# EAGLE board K019 with eeprom (EAGLE 6.3), part 1 of 4
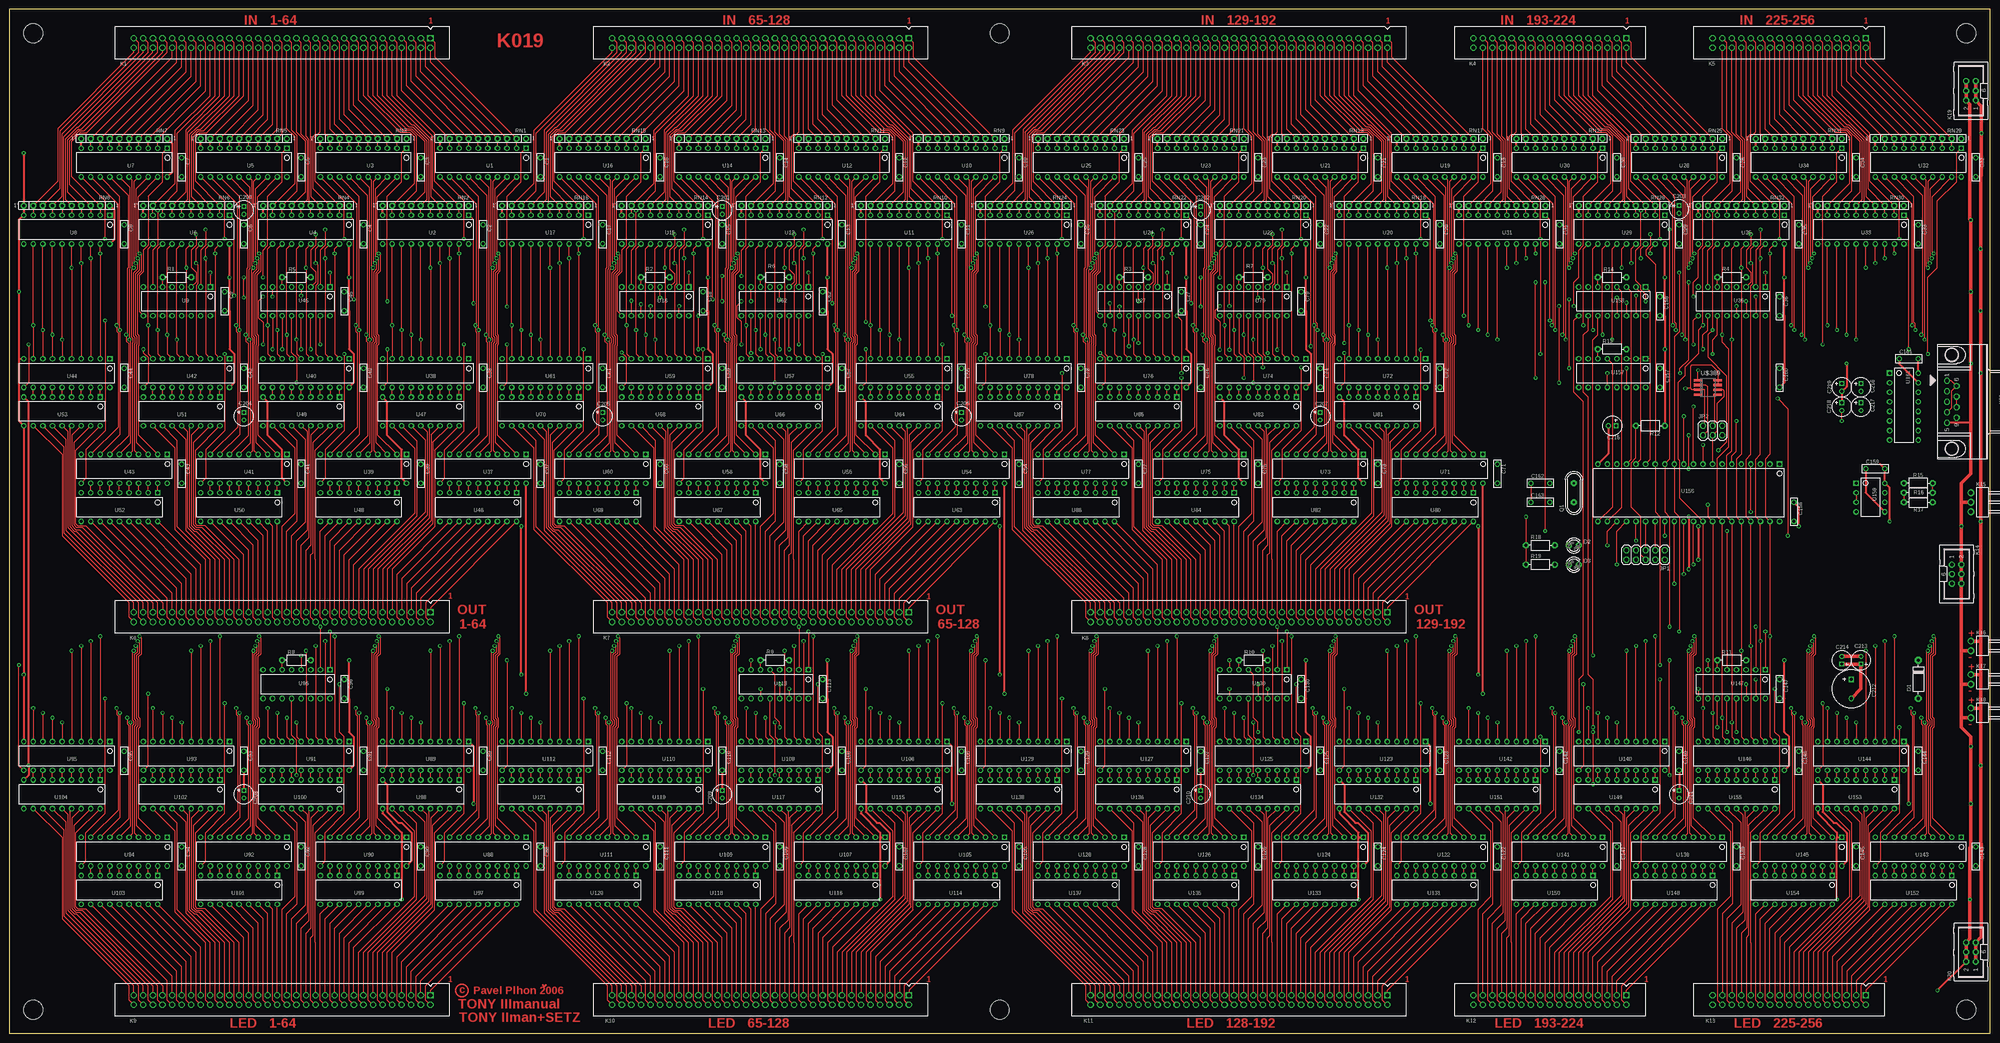
[diagram p5: board, top side]
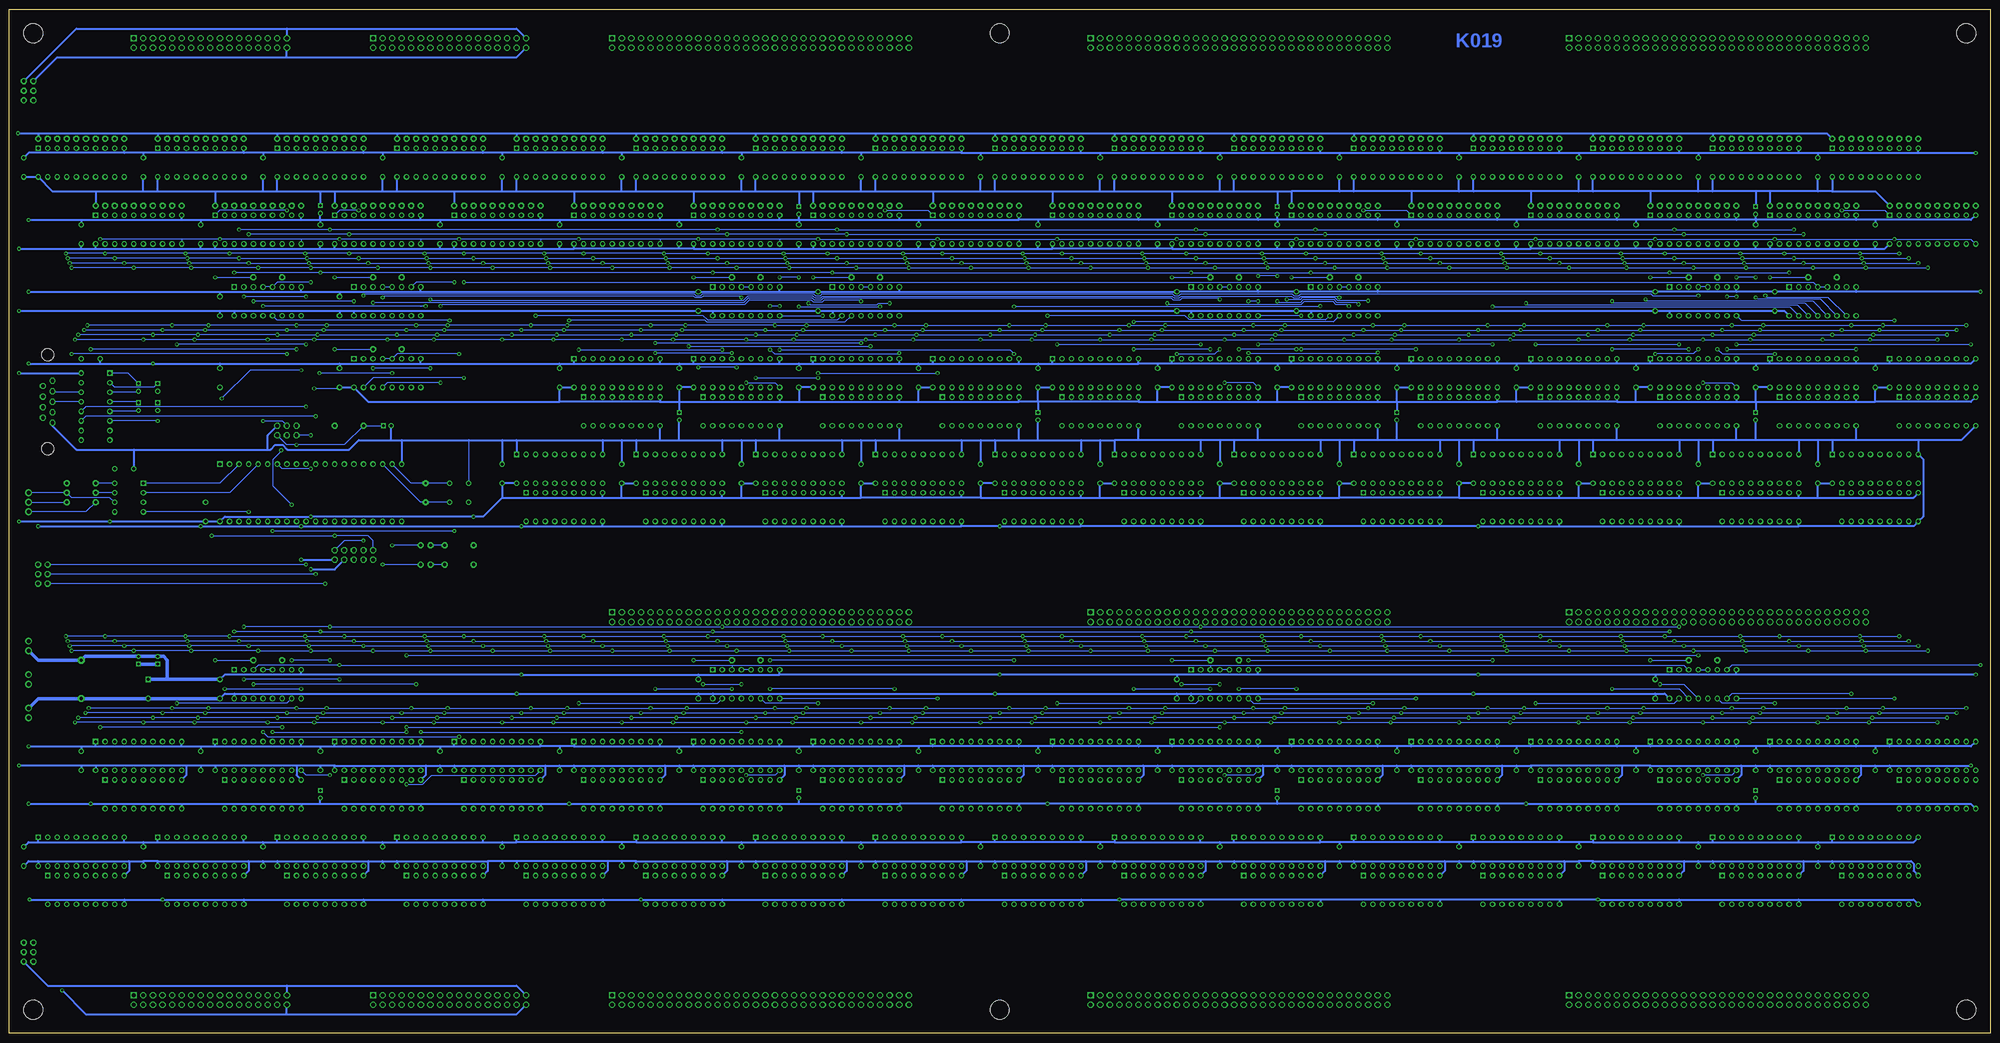
[diagram p6: board, bottom side, seen from below]

Size 525.78 x 271.78 mm. Coordinates in mm from the lower left corner, seen from the top.
Outline: 0,0 525.78,0 525.78,271.78 0,271.78 0,0
Copper layers (1*16): Top 0.035mm / dielectric 1.5mm / Bottom 0.035mm
Design rules "default": minimum track width 10mil, minimum drill 24mil, track to track 8mil, track to pad 8mil, pad to pad 8mil, via to via 8mil, smd to smd 8mil, copper to edge 40mil, drill to drill 8mil, minimum pad ring 10mil, minimum via ring 8mil, stop-mask expansion 4mil, vias tented up to drill 0mil, thermal gap 10mil
Holes 5.08 mm at 6.35,265.43 6.35,6.35 519.43,6.35 519.43,265.43 262.89,265.43 262.89,6.35

## Footprints (pad centres in the part's own frame; a part is rotated, then mirrored left to right if it is on the bottom)
C-5-2X8 = drill 0.813 pad 1.397: 1 0,0; 2 5.08,0
EC-2/5 = drill 0.711 pad 1.092: 1 1.016,0 | drill 0.711 pad 1.092 square: 2 -1.016,0
EC-5 = drill 0.813 pad 1.397 square: 1 -2.54,0 | drill 0.813 pad 1.397: 2 2.54,0
D-10 = drill 0.813 pad 1.778 octagon: 1 -5.08,0; 2 5.08,0
LED3 = drill 0.813 pad 1.6 octagon: A -1.27,0 | drill 0.813 pad 1.6: K 1.27,0
2X05 = drill 1.016 pad 1.6 octagon: 1 -5.08,-1.27; 2 -5.08,1.27; 3 -2.54,-1.27; 4 -2.54,1.27; 5 0,-1.27; 6 0,1.27; 7 2.54,-1.27; 8 2.54,1.27; 9 5.08,-1.27; 10 5.08,1.27
2X03 = drill 1.016 pad 1.6 octagon: 1 -2.54,-1.27; 2 -2.54,1.27; 3 0,-1.27; 4 0,1.27; 5 2.54,-1.27; 6 2.54,1.27
KON64 = drill 1.092 pad 1.6 square: 1 0,0 | drill 1.092 pad 1.6: 2 0,2.54; 3 2.54,0; 4 2.54,2.54; 5 5.08,0; 6 5.08,2.54; 7 7.62,0; 8 7.62,2.54; 9 10.16,0; 10 10.16,2.54; 11 12.7,0; 12 12.7,2.54; 13 15.24,0; 14 15.24,2.54; 15 17.78,0; 16 17.78,2.54; 17 20.32,0; 18 20.32,2.54; 19 22.86,0; 20 22.86,2.54; 21 25.4,0; 22 25.4,2.54; 23 27.94,0; 24 27.94,2.54; 25 30.48,0; 26 30.48,2.54; 27 33.02,0; 28 33.02,2.54; 29 35.56,0; 30 35.56,2.54; 31 38.1,0; 32 38.1,2.54; 33 40.64,0; 34 40.64,2.54; 35 43.18,0; 36 43.18,2.54; 37 45.72,0; 38 45.72,2.54; 39 48.26,0; 40 48.26,2.54; 41 50.8,0; 42 50.8,2.54; 43 53.34,0; 44 53.34,2.54; 45 55.88,0; 46 55.88,2.54; 47 58.42,0; 48 58.42,2.54; 49 60.96,0; 50 60.96,2.54; 51 63.5,0; 52 63.5,2.54; 53 66.04,0; 54 66.04,2.54; 55 68.58,0; 56 68.58,2.54; 57 71.12,0; 58 71.12,2.54; 59 73.66,0; 60 73.66,2.54; 61 76.2,0; 62 76.2,2.54; 63 78.74,0; 64 78.74,2.54
KON34 = drill 1.092 pad 1.6 square: 1 0,0 | drill 1.092 pad 1.6: 2 0,2.54; 3 2.54,0; 4 2.54,2.54; 5 5.08,0; 6 5.08,2.54; 7 7.62,0; 8 7.62,2.54; 9 10.16,0; 10 10.16,2.54; 11 12.7,0; 12 12.7,2.54; 13 15.24,0; 14 15.24,2.54; 15 17.78,0; 16 17.78,2.54; 17 20.32,0; 18 20.32,2.54; 19 22.86,0; 20 22.86,2.54; 21 25.4,0; 22 25.4,2.54; 23 27.94,0; 24 27.94,2.54; 25 30.48,0; 26 30.48,2.54; 27 33.02,0; 28 33.02,2.54; 29 35.56,0; 30 35.56,2.54; 31 38.1,0; 32 38.1,2.54; 33 40.64,0; 34 40.64,2.54
ML6 = drill 0.914 pad 1.6: 1 -2.54,-1.27 | drill 0.914 pad 1.6 octagon: 2 -2.54,1.27; 3 0,-1.27; 4 0,1.27; 5 2.54,-1.27; 6 2.54,1.27
PSH02-03 = drill 1.092 pad 1.803: 1 0,0; 2 2.54,0; 3 5.08,0
PSH02-02 = drill 1.092 pad 1.803: 1 0,0; 2 2.54,0
ML06 = drill 0.914 pad 1.6: 1 -2.54,-1.27 | drill 0.914 pad 1.6 octagon: 2 -2.54,1.27; 3 0,-1.27; 4 0,1.27; 5 2.54,-1.27; 6 2.54,1.27
D-09F/90 = drill 1.016 pad 1.575 octagon: 1 -5.588,-1.27; 2 -2.794,-1.27; 3 0,-1.27; 4 2.794,-1.27; 5 5.588,-1.27; 6 -4.191,1.27; 7 -1.397,1.27; 8 1.397,1.27; 9 4.191,1.27 | hole 3.2: 12.446,0; -12.446,0
QS = drill 0.61 pad 1.6 octagon: 1 -2.54,0; 2 2.54,0
R-7,5 = drill 0.813 pad 1.6 octagon: 1 -3.81,0; 2 3.81,0
G08R+ = drill 0.813 pad 1.6: 1 -10.16,0; 10 12.7,0 | drill 0.813 pad 1.6 octagon: 2 -7.62,0; 3 -5.08,0; 4 -2.54,0; 5 0,0; 6 2.54,0; 7 5.08,0; 8 7.62,0; 9 10.16,0
DIL20 = drill 0.813 pad 1.397 square: 1 0,0 | drill 0.813 pad 1.397: 2 2.54,0; 3 5.08,0; 4 7.62,0; 5 10.16,0; 6 12.7,0; 7 15.24,0; 8 17.78,0; 9 20.32,0; 10 22.86,0; 11 22.86,7.62; 12 20.32,7.62; 13 17.78,7.62; 14 15.24,7.62; 15 12.7,7.62; 16 10.16,7.62; 17 7.62,7.62; 18 5.08,7.62; 19 2.54,7.62; 20 0,7.62
DIL16 = drill 0.813 pad 1.397 square: 1 0,0 | drill 0.813 pad 1.397: 2 2.54,0; 3 5.08,0; 4 7.62,0; 5 10.16,0; 6 12.7,0; 7 15.24,0; 8 17.78,0; 9 17.78,7.62; 10 15.24,7.62; 11 12.7,7.62; 12 10.16,7.62; 13 7.62,7.62; 14 5.08,7.62; 15 2.54,7.62; 16 0,7.62
DIL18 = drill 0.813 pad 1.397 square: 1 0,0 | drill 0.813 pad 1.397: 2 2.54,0; 3 5.08,0; 4 7.62,0; 5 10.16,0; 6 12.7,0; 7 15.24,0; 8 17.78,0; 9 20.32,0; 10 20.32,7.62; 11 17.78,7.62; 12 15.24,7.62; 13 12.7,7.62; 14 10.16,7.62; 15 7.62,7.62; 16 5.08,7.62; 17 2.54,7.62; 18 0,7.62
DIL40 = drill 0.813 pad 1.397 square: 1 -24.13,-7.62 | drill 0.813 pad 1.397: 2 -21.59,-7.62; 3 -19.05,-7.62; 4 -16.51,-7.62; 5 -13.97,-7.62; 6 -11.43,-7.62; 7 -8.89,-7.62; 8 -6.35,-7.62; 9 -3.81,-7.62; 10 -1.27,-7.62; 11 1.27,-7.62; 12 3.81,-7.62; 13 6.35,-7.62; 14 8.89,-7.62; 15 11.43,-7.62; 16 13.97,-7.62; 17 16.51,-7.62; 18 19.05,-7.62; 19 21.59,-7.62; 20 24.13,-7.62; 21 24.13,7.62; 22 21.59,7.62; 23 19.05,7.62; 24 16.51,7.62; 25 13.97,7.62; 26 11.43,7.62; 27 8.89,7.62; 28 6.35,7.62; 29 3.81,7.62; 30 1.27,7.62; 31 -1.27,7.62; 32 -3.81,7.62; 33 -6.35,7.62; 34 -8.89,7.62; 35 -11.43,7.62; 36 -13.97,7.62; 37 -16.51,7.62; 38 -19.05,7.62; 39 -21.59,7.62; 40 -24.13,7.62
DIL-08 = drill 0.813 pad 1.397 square: 1 0,0 | drill 0.813 pad 1.397: 2 2.54,0; 3 5.08,0; 4 7.62,0; 5 7.62,7.62; 6 5.08,7.62; 7 2.54,7.62; 8 0,7.62
SO08 = smd 0.6 x 2.2: 1 -1.905,-2.6; 2 -0.635,-2.6; 3 0.635,-2.6; 4 1.905,-2.6; 5 1.905,2.6; 6 0.635,2.6; 7 -0.635,2.6; 8 -1.905,2.6

## Placement (x,y rotation side)
C1  100n  [C-5-2X8]  140.97,232.41 270 top
C2  100n  [C-5-2X8]  125.73,214.63 270 top
C3  100n  [C-5-2X8]  109.22,232.41 270 top
C4  100n  [C-5-2X8]  93.98,214.63 270 top
C5  100n  [C-5-2X8]  77.47,232.41 270 top
C6  100n  [C-5-2X8]  62.23,214.63 270 top
C7  100n  [C-5-2X8]  45.72,232.41 270 top
C8  100n  [C-5-2X8]  30.48,214.63 270 top
C9  100n  [C-5-2X8]  57.15,196.85 270 top
C10  100n  [C-5-2X8]  267.97,232.41 270 top
C11  100n  [C-5-2X8]  252.73,214.63 270 top
C12  100n  [C-5-2X8]  236.22,232.41 270 top
C13  100n  [C-5-2X8]  220.98,214.63 270 top
C14  100n  [C-5-2X8]  204.47,232.41 270 top
C15  100n  [C-5-2X8]  189.23,214.63 270 top
C16  100n  [C-5-2X8]  172.72,232.41 270 top
C17  100n  [C-5-2X8]  157.48,214.63 270 top
C18  100n  [C-5-2X8]  184.15,196.85 270 top
C19  100n  [C-5-2X8]  394.97,232.41 270 top
C20  100n  [C-5-2X8]  379.73,214.63 270 top
C21  100n  [C-5-2X8]  363.22,232.41 270 top
C22  100n  [C-5-2X8]  347.98,214.63 270 top
C23  100n  [C-5-2X8]  331.47,232.41 270 top
C24  100n  [C-5-2X8]  316.23,214.63 270 top
C25  100n  [C-5-2X8]  299.72,232.41 270 top
C26  100n  [C-5-2X8]  284.48,214.63 270 top
C27  100n  [C-5-2X8]  311.15,196.85 270 top
C28  100n  [C-5-2X8]  458.47,232.41 270 top
C29  100n  [C-5-2X8]  443.23,214.63 270 top
C30  100n  [C-5-2X8]  426.72,232.41 270 top
C31  100n  [C-5-2X8]  411.48,214.63 270 top
C32  100n  [C-5-2X8]  521.97,232.41 270 top
C33  100n  [C-5-2X8]  506.73,214.63 270 top
C34  100n  [C-5-2X8]  490.22,232.41 270 top
C35  100n  [C-5-2X8]  474.98,214.63 270 top
C36  100n  [C-5-2X8]  469.9,195.58 270 top
C37  100n  [C-5-2X8]  140.97,151.13 270 top
C38  100n  [C-5-2X8]  125.73,176.53 270 top
C39  100n  [C-5-2X8]  109.22,151.13 270 top
C40  100n  [C-5-2X8]  93.98,176.53 270 top
C41  100n  [C-5-2X8]  77.47,151.13 270 top
C42  100n  [C-5-2X8]  62.23,176.53 270 top
C43  100n  [C-5-2X8]  45.72,151.13 270 top
C44  100n  [C-5-2X8]  30.48,176.53 270 top
C45  100n  [C-5-2X8]  88.9,196.85 270 top
C54  100n  [C-5-2X8]  267.97,151.13 270 top
C55  100n  [C-5-2X8]  252.73,176.53 270 top
C56  100n  [C-5-2X8]  236.22,151.13 270 top
C57  100n  [C-5-2X8]  220.98,176.53 270 top
C58  100n  [C-5-2X8]  204.47,151.13 270 top
C59  100n  [C-5-2X8]  189.23,176.53 270 top
C60  100n  [C-5-2X8]  172.72,151.13 270 top
C61  100n  [C-5-2X8]  157.48,176.53 270 top
C62  100n  [C-5-2X8]  215.9,196.85 270 top
C71  100n  [C-5-2X8]  394.97,151.13 270 top
C72  100n  [C-5-2X8]  379.73,176.53 270 top
C73  100n  [C-5-2X8]  363.22,151.13 270 top
C74  100n  [C-5-2X8]  347.98,176.53 270 top
C75  100n  [C-5-2X8]  331.47,151.13 270 top
C76  100n  [C-5-2X8]  316.23,176.53 270 top
C77  100n  [C-5-2X8]  299.72,151.13 270 top
C78  100n  [C-5-2X8]  284.48,176.53 270 top
C79  100n  [C-5-2X8]  342.9,196.85 270 top
C88  100n  [C-5-2X8]  140.97,49.53 270 top
C89  100n  [C-5-2X8]  125.73,74.93 270 top
C90  100n  [C-5-2X8]  109.22,49.53 270 top
C91  100n  [C-5-2X8]  93.98,74.93 270 top
C92  100n  [C-5-2X8]  77.47,49.53 270 top
C93  100n  [C-5-2X8]  62.23,74.93 270 top
C94  100n  [C-5-2X8]  45.72,49.53 270 top
C95  100n  [C-5-2X8]  30.48,74.93 270 top
C96  100n  [C-5-2X8]  88.9,93.98 270 top
C105  100n  [C-5-2X8]  267.97,49.53 270 top
C106  100n  [C-5-2X8]  252.73,74.93 270 top
C107  100n  [C-5-2X8]  236.22,49.53 270 top
C108  100n  [C-5-2X8]  220.98,74.93 270 top
C109  100n  [C-5-2X8]  204.47,49.53 270 top
C110  100n  [C-5-2X8]  189.23,74.93 270 top
C111  100n  [C-5-2X8]  172.72,49.53 270 top
C112  100n  [C-5-2X8]  157.48,74.93 270 top
C113  100n  [C-5-2X8]  215.9,93.98 270 top
C122  100n  [C-5-2X8]  394.97,49.53 270 top
C123  100n  [C-5-2X8]  379.73,74.93 270 top
C124  100n  [C-5-2X8]  363.22,49.53 270 top
C125  100n  [C-5-2X8]  347.98,74.93 270 top
C126  100n  [C-5-2X8]  331.47,49.53 270 top
C127  100n  [C-5-2X8]  316.23,74.93 270 top
C128  100n  [C-5-2X8]  299.72,49.53 270 top
C129  100n  [C-5-2X8]  284.48,74.93 270 top
C130  100n  [C-5-2X8]  342.9,93.98 270 top
C139  100n  [C-5-2X8]  458.47,49.53 270 top
C140  100n  [C-5-2X8]  443.23,74.93 270 top
C141  100n  [C-5-2X8]  426.72,49.53 270 top
C142  100n  [C-5-2X8]  411.48,74.93 270 top
C143  100n  [C-5-2X8]  521.97,49.53 270 top
C144  100n  [C-5-2X8]  506.73,74.93 270 top
C145  100n  [C-5-2X8]  490.22,49.53 270 top
C146  100n  [C-5-2X8]  474.98,74.93 270 top
C147  100n  [C-5-2X8]  469.9,93.98 270 top
C156  100n  [C-5-2X8]  473.71,140.97 270 top
C157  100n  [C-5-2X8]  438.15,176.53 270 top
C158  100n  [C-5-2X8]  438.15,195.58 270 top
C159  100n  [C-5-2X8]  492.76,149.86 0 top
C160  100n  [C-5-2X8]  469.9,176.53 270 top
C161  100n  [C-5-2X8]  501.65,179.07 0 top
C162  22  [C-5-2X8]  403.86,146.05 0 top
C163  22  [C-5-2X8]  403.86,140.97 0 top
C200  22M  [EC-2/5]  62.23,218.44 270 top
C201  22M  [EC-2/5]  189.23,218.44 270 top
C202  22M  [EC-2/5]  316.23,218.44 270 top
C203  22M  [EC-2/5]  443.23,218.69 270 top
C204  22M  [EC-2/5]  62.23,163.83 270 top
C205  22M  [EC-2/5]  157.48,163.83 270 top
C206  22M  [EC-2/5]  252.73,163.83 270 top
C207  22M  [EC-2/5]  347.98,163.83 270 top
C208  22M  [EC-2/5]  62.23,63.5 270 top
C209  22M  [EC-2/5]  189.23,63.5 270 top
C210  22M  [EC-2/5]  316.23,63.5 270 top
C211  22M  [EC-2/5]  443.23,63.5 270 top
C212  220M  [EC-5]  488.95,91.44 270 top
C213  22M  [EC-2/5]  491.49,99.06 90 top
C214  22M  [EC-2/5]  486.41,99.06 90 top
C215  2M2  [EC-2/5]  425.45,161.29 180 top
C216  2M2  [EC-2/5]  491.49,171.45 270 top
C217  2M2  [EC-2/5]  491.49,166.37 270 top
C218  2M2  [EC-2/5]  486.41,166.37 270 top
C219  2M2  [EC-2/5]  486.41,171.45 270 top
D1  5V6  [D-10]  506.73,93.98 90 top
D2  LEDG  [LED3]  415.29,129.54 0 top
D3  LEDR  [LED3]  415.29,124.46 0 top
JP1  JTAG  [2X05]  434.34,127 180 top
JP2  ISP  [2X03]  452.12,160.02 0 top
K1  KON64  [KON64]  111.76,264.16 180 top
K2  KON64  [KON64]  238.76,264.16 180 top
K3  KON64  [KON64]  365.76,264.16 180 top
K4  KON34  [KON34]  429.26,264.16 180 top
K5  KON34  [KON34]  492.76,264.16 180 top
K6  KON64  [KON64]  111.76,111.76 180 top
K7  KON64  [KON64]  238.76,111.76 180 top
K8  KON64  [KON64]  365.76,111.76 180 top
K9  KON64  [KON64]  111.76,10.16 180 top
K10  KON64  [KON64]  238.76,10.16 180 top
K11  KON64  [KON64]  365.76,10.16 180 top
K12  KON34  [KON34]  429.26,10.16 180 top
K13  KON34  [KON34]  492.76,10.16 180 top
K14  KLIC  [ML6]  516.89,121.92 270 top
K15  PSH02-03W  [PSH02-03]  520.7,143.51 270 top
K16  PSH02-02W  [PSH02-02]  520.7,104.14 270 top
K17  PSH02-02W  [PSH02-02]  520.7,95.25 270 top
K18  PSH02-02W  [PSH02-02]  520.7,86.36 270 top
K19  PWR  [ML06]  520.7,250.19 90 top
K20  PWR  [ML06]  520.7,21.59 90 top
K21  RS232  [D-09F/90]  515.62,167.64 270 top
Q1  14.745MHz  [QS]  415.29,143.51 90 top
R1  1k  [R-7,5]  44.45,200.66 0 top
R2  1k  [R-7,5]  171.45,200.66 0 top
R3  1k  [R-7,5]  298.45,200.66 0 top
R4  1k  [R-7,5]  457.2,200.66 0 top
R5  1k  [R-7,5]  76.2,200.66 180 top
R6  1k  [R-7,5]  203.2,200.66 180 top
R7  1k  [R-7,5]  330.2,200.66 180 top
R8  1k  [R-7,5]  76.2,99.06 180 top
R9  1k  [R-7,5]  203.2,99.06 180 top
R10  1k  [R-7,5]  330.2,99.06 180 top
R11  1k  [R-7,5]  457.2,99.06 180 top
R12  10k  [R-7,5]  435.61,161.29 180 top
R13  1k  [R-7,5]  425.45,181.61 180 top
R14  1k  [R-7,5]  425.45,200.66 180 top
R15  2k2  [R-7,5]  506.73,146.05 180 top
R16  120  [R-7,5]  506.73,143.51 0 top
R17  2k2  [R-7,5]  506.73,140.97 180 top
R18  1k  [R-7,5]  406.4,129.54 0 top
R19  1k  [R-7,5]  406.4,124.46 0 top
RN1  8x47k  [G08R+]  127,237.49 180 top
RN2  8x47k  [G08R+]  111.76,219.71 180 top
RN3  8x47k  [G08R+]  95.25,237.49 180 top
RN4  8x47k  [G08R+]  80.01,219.71 180 top
RN5  8x47k  [G08R+]  63.5,237.49 180 top
RN6  8x47k  [G08R+]  48.26,219.71 180 top
RN7  8x47k  [G08R+]  31.75,237.49 180 top
RN8  8x47k  [G08R+]  16.51,219.71 180 top
RN9  8x47k  [G08R+]  254,237.49 180 top
RN10  8x47k  [G08R+]  238.76,219.71 180 top
RN11  8x47k  [G08R+]  222.25,237.49 180 top
RN12  8x47k  [G08R+]  207.01,219.71 180 top
RN13  8x47k  [G08R+]  190.5,237.49 180 top
RN14  8x47k  [G08R+]  175.26,219.71 180 top
RN15  8x47k  [G08R+]  158.75,237.49 180 top
RN16  8x47k  [G08R+]  143.51,219.71 180 top
RN17  8x47k  [G08R+]  381,237.49 180 top
RN18  8x47k  [G08R+]  365.76,219.71 180 top
RN19  8x47k  [G08R+]  349.25,237.49 180 top
RN20  8x47k  [G08R+]  334.01,219.71 180 top
RN21  8x47k  [G08R+]  317.5,237.49 180 top
RN22  8x47k  [G08R+]  302.26,219.71 180 top
RN23  8x47k  [G08R+]  285.75,237.49 180 top
RN24  8x47k  [G08R+]  270.51,219.71 180 top
RN25  8x47k  [G08R+]  444.5,237.49 180 top
RN26  8x47k  [G08R+]  429.26,219.71 180 top
RN27  8x47k  [G08R+]  412.75,237.49 180 top
RN28  8x47k  [G08R+]  397.51,219.71 180 top
RN29  8x47k  [G08R+]  508,237.49 180 top
RN30  8x47k  [G08R+]  492.76,219.71 180 top
RN31  8x47k  [G08R+]  476.25,237.49 180 top
RN32  8x47k  [G08R+]  461.01,219.71 180 top
U1  74HC573  [DIL20]  137.16,234.95 180 top
U2  74HC573  [DIL20]  121.92,217.17 180 top
U3  74HC573  [DIL20]  105.41,234.95 180 top
U4  74HC573  [DIL20]  90.17,217.17 180 top
U5  74HC573  [DIL20]  73.66,234.95 180 top
U6  74AC573  [DIL20]  58.42,217.17 180 top
U7  74HC573  [DIL20]  41.91,234.95 180 top
U8  74HC573  [DIL20]  26.67,217.17 180 top
U9  74AC138  [DIL16]  53.34,198.12 180 top
U10  74HC573  [DIL20]  264.16,234.95 180 top
U11  74HC573  [DIL20]  248.92,217.17 180 top
U12  74HC573  [DIL20]  232.41,234.95 180 top
U13  74HC573  [DIL20]  217.17,217.17 180 top
U14  74HC573  [DIL20]  200.66,234.95 180 top
U15  74AC573  [DIL20]  185.42,217.17 180 top
U16  74HC573  [DIL20]  168.91,234.95 180 top
U17  74HC573  [DIL20]  153.67,217.17 180 top
U18  74AC138  [DIL16]  180.34,198.12 180 top
U19  74HC573  [DIL20]  391.16,234.95 180 top
U20  74HC573  [DIL20]  375.92,217.17 180 top
U21  74HC573  [DIL20]  359.41,234.95 180 top
U22  74HC573  [DIL20]  344.17,217.17 180 top
U23  74HC573  [DIL20]  327.66,234.95 180 top
U24  74AC573  [DIL20]  312.42,217.17 180 top
U25  74HC573  [DIL20]  295.91,234.95 180 top
U26  74HC573  [DIL20]  280.67,217.17 180 top
U27  74AC138  [DIL16]  307.34,198.12 180 top
U28  74HC573  [DIL20]  454.66,234.95 180 top
U29  74HC573  [DIL20]  439.42,217.17 180 top
U30  74HC573  [DIL20]  422.91,234.95 180 top
U31  74HC573  [DIL20]  407.67,217.17 180 top
U32  74HC573  [DIL20]  518.16,234.95 180 top
U33  74AC573  [DIL20]  502.92,217.17 180 top
U34  74HC573  [DIL20]  486.41,234.95 180 top
U35  74HC573  [DIL20]  471.17,217.17 180 top
U36  74AC138  [DIL16]  466.09,198.12 180 top
U37  74HC574  [DIL20]  137.16,153.67 180 top
U38  74HC574  [DIL20]  121.92,179.07 180 top
U39  74HC574  [DIL20]  105.41,153.67 180 top
U40  74HC574  [DIL20]  90.17,179.07 180 top
U41  74HC574  [DIL20]  73.66,153.67 180 top
U42  74HC574  [DIL20]  58.42,179.07 180 top
U43  74HC574  [DIL20]  41.91,153.67 180 top
U44  74HC574  [DIL20]  26.67,179.07 180 top
U45  74HC138  [DIL16]  85.09,198.12 180 top
U46  TD62783F  [DIL18]  134.62,143.51 180 top
U47  TD62783F  [DIL18]  119.38,168.91 180 top
U48  TD62783F  [DIL18]  102.87,143.51 180 top
U49  TD62783F  [DIL18]  87.63,168.91 180 top
U50  TD62783F  [DIL18]  71.12,143.51 180 top
U51  TD62783F  [DIL18]  55.88,168.91 180 top
U52  TD62783F  [DIL18]  39.37,143.51 180 top
U53  TD62783F  [DIL18]  24.13,168.91 180 top
U54  74HC574  [DIL20]  264.16,153.67 180 top
U55  74HC574  [DIL20]  248.92,179.07 180 top
U56  74HC574  [DIL20]  232.41,153.67 180 top
U57  74HC574  [DIL20]  217.17,179.07 180 top
U58  74HC574  [DIL20]  200.66,153.67 180 top
U59  74HC574  [DIL20]  185.42,179.07 180 top
U60  74HC574  [DIL20]  168.91,153.67 180 top
U61  74HC574  [DIL20]  153.67,179.07 180 top
U62  74HC138  [DIL16]  212.09,198.12 180 top
U63  TD62783F  [DIL18]  261.62,143.51 180 top
U64  TD62783F  [DIL18]  246.38,168.91 180 top
U65  TD62783F  [DIL18]  229.87,143.51 180 top
U66  TD62783F  [DIL18]  214.63,168.91 180 top
U67  TD62783F  [DIL18]  198.12,143.51 180 top
U68  TD62783F  [DIL18]  182.88,168.91 180 top
U69  TD62783F  [DIL18]  166.37,143.51 180 top
U70  TD62783F  [DIL18]  151.13,168.91 180 top
U71  74HC574  [DIL20]  391.16,153.67 180 top
U72  74HC574  [DIL20]  375.92,179.07 180 top
U73  74HC574  [DIL20]  359.41,153.67 180 top
U74  74HC574  [DIL20]  344.17,179.07 180 top
U75  74HC574  [DIL20]  327.66,153.67 180 top
U76  74HC574  [DIL20]  312.42,179.07 180 top
U77  74HC574  [DIL20]  295.91,153.67 180 top
U78  74HC574  [DIL20]  280.67,179.07 180 top
U79  74HC138  [DIL16]  339.09,198.12 180 top
U80  TD62783F  [DIL18]  388.62,143.51 180 top
U81  TD62783F  [DIL18]  373.38,168.91 180 top
U82  TD62783F  [DIL18]  356.87,143.51 180 top
U83  TD62783F  [DIL18]  341.63,168.91 180 top
U84  TD62783F  [DIL18]  325.12,143.51 180 top
U85  TD62783F  [DIL18]  309.88,168.91 180 top
U86  TD62783F  [DIL18]  293.37,143.51 180 top
U87  TD62783F  [DIL18]  278.13,168.91 180 top
U88  74HC574  [DIL20]  137.16,52.07 180 top
U89  74HC574  [DIL20]  121.92,77.47 180 top
U90  74HC574  [DIL20]  105.41,52.07 180 top
U91  74HC574  [DIL20]  90.17,77.47 180 top
U92  74HC574  [DIL20]  73.66,52.07 180 top
U93  74HC574  [DIL20]  58.42,77.47 180 top
U94  74HC574  [DIL20]  41.91,52.07 180 top
U95  74HC574  [DIL20]  26.67,77.47 180 top
U96  74HC138  [DIL16]  85.09,96.52 180 top
U97  TD62783F  [DIL18]  134.62,41.91 180 top
U98  TD62783F  [DIL18]  119.38,67.31 180 top
U99  TD62783F  [DIL18]  102.87,41.91 180 top
U100  TD62783F  [DIL18]  87.63,67.31 180 top
U101  TD62783F  [DIL18]  71.12,41.91 180 top
U102  TD62783F  [DIL18]  55.88,67.31 180 top
U103  TD62783F  [DIL18]  39.37,41.91 180 top
U104  TD62783F  [DIL18]  24.13,67.31 180 top
U105  74HC574  [DIL20]  264.16,52.07 180 top
U106  74HC574  [DIL20]  248.92,77.47 180 top
U107  74HC574  [DIL20]  232.41,52.07 180 top
U108  74HC574  [DIL20]  217.17,77.47 180 top
U109  74HC574  [DIL20]  200.66,52.07 180 top
U110  74HC574  [DIL20]  185.42,77.47 180 top
U111  74HC574  [DIL20]  168.91,52.07 180 top
U112  74HC574  [DIL20]  153.67,77.47 180 top
U113  74HC138  [DIL16]  212.09,96.52 180 top
U114  TD62783F  [DIL18]  261.62,41.91 180 top
U115  TD62783F  [DIL18]  246.38,67.31 180 top
U116  TD62783F  [DIL18]  229.87,41.91 180 top
U117  TD62783F  [DIL18]  214.63,67.31 180 top
U118  TD62783F  [DIL18]  198.12,41.91 180 top
U119  TD62783F  [DIL18]  182.88,67.31 180 top
U120  TD62783F  [DIL18]  166.37,41.91 180 top
U121  TD62783F  [DIL18]  151.13,67.31 180 top
U122  74HC574  [DIL20]  391.16,52.07 180 top
U123  74HC574  [DIL20]  375.92,77.47 180 top
U124  74HC574  [DIL20]  359.41,52.07 180 top
U125  74HC574  [DIL20]  344.17,77.47 180 top
U126  74HC574  [DIL20]  327.66,52.07 180 top
U127  74HC574  [DIL20]  312.42,77.47 180 top
U128  74HC574  [DIL20]  295.91,52.07 180 top
U129  74HC574  [DIL20]  280.67,77.47 180 top
U130  74HC138  [DIL16]  339.09,96.52 180 top
U131  TD62783F  [DIL18]  388.62,41.91 180 top
U132  TD62783F  [DIL18]  373.38,67.31 180 top
U133  TD62783F  [DIL18]  356.87,41.91 180 top
U134  TD62783F  [DIL18]  341.63,67.31 180 top
U135  TD62783F  [DIL18]  325.12,41.91 180 top
U136  TD62783F  [DIL18]  309.88,67.31 180 top
U137  TD62783F  [DIL18]  293.37,41.91 180 top
U138  TD62783F  [DIL18]  278.13,67.31 180 top
U139  74HC574  [DIL20]  454.66,52.07 180 top
U140  74HC574  [DIL20]  439.42,77.47 180 top
U141  74HC574  [DIL20]  422.91,52.07 180 top
U142  74HC574  [DIL20]  407.67,77.47 180 top
U143  74HC574  [DIL20]  518.16,52.07 180 top
U144  74HC574  [DIL20]  502.92,77.47 180 top
U145  74HC574  [DIL20]  486.41,52.07 180 top
U146  74HC574  [DIL20]  471.17,77.47 180 top
U147  74HC138  [DIL16]  466.09,96.52 180 top
U148  TD62783F  [DIL18]  452.12,41.91 180 top
U149  TD62783F  [DIL18]  436.88,67.31 180 top
U150  TD62783F  [DIL18]  420.37,41.91 180 top
U151  TD62783F  [DIL18]  405.13,67.31 180 top
U152  TD62783F  [DIL18]  515.62,41.91 180 top
U153  TD62783F  [DIL18]  500.38,67.31 180 top
U154  TD62783F  [DIL18]  483.87,41.91 180 top
U155  TD62783F  [DIL18]  468.63,67.31 180 top
U156  MEGA162  [DIL40]  445.77,143.51 180 top
U157  74HC138  [DIL16]  434.34,179.07 180 top
U158  74HC138  [DIL16]  434.34,198.12 180 top
U159  SP485  [DIL-08]  490.22,146.05 270 top
U161  MAX232  [DIL16]  499.11,175.26 270 top
U$389  M95XXSO  [SO08]  450.85,171.45 270 top

## Tracks (layer width: path | path; a pad name or v marks a point on that pad's centre or on a via)
A0  (via drill 0.51 pad 0.99)
  Top 0.254: v53.34,201.93 U9.1 | v85.09,201.93 U45.1 | v466.09,201.93 U36.1 | v339.09,201.93 U79.1 | v307.34,201.93 U27.1 | v212.09,201.93 U62.1 | v180.34,201.93 U18.1 | v85.09,106.68 U96.1 | v466.09,106.68 U147.1 | v339.09,106.68 U130.1 | v212.09,106.68 U113.1 | v443.23,201.93 443.23,186.18 441.96,184.91 U156.12 441.96,138.43 443.23,137.16 v443.23,106.68
  Bottom 0.254: v53.34,201.93 v85.09,201.93 v180.34,201.93 v212.09,201.93 v307.34,201.93 v339.09,201.93 v443.23,201.93 v466.09,201.93 | v466.09,106.68 v443.23,106.68 v339.09,106.68 v212.09,106.68 v85.09,106.68
A1  (via drill 0.51 pad 0.99)
  Top 0.254: U9.2 50.8,207.9 52.07,209.17 v52.07,213.36 | U36.2 463.55,207.9 464.82,209.17 v464.82,213.36 | U27.2 304.8,207.9 306.07,209.17 v306.07,213.36 | U79.2 336.55,207.9 337.82,209.17 v337.82,213.36 | U62.2 209.55,207.9 210.82,209.17 v210.82,213.36 | U18.2 177.8,207.9 179.07,209.17 v179.07,213.36 | U45.2 82.55,207.9 83.82,209.17 v83.82,213.36 | v82.55,107.95 U96.2 | v463.55,107.95 U147.2 | v336.55,107.95 U130.2 | v209.55,107.95 U113.2 | v440.69,213.36 440.69,152.4 U156.13 439.42,138.43 440.69,137.16 v440.69,107.95
  Bottom 0.254: v52.07,213.36 v83.82,213.36 v179.07,213.36 v210.82,213.36 v306.07,213.36 v337.82,213.36 v440.69,213.36 v464.82,213.36 | v82.55,107.95 v209.55,107.95 v336.55,107.95 v440.69,107.95 v463.55,107.95
A2  (via drill 0.51 pad 0.99)
  Top 0.254: U9.3 49.53,199.39 49.53,202.06 48.26,203.33 48.26,207.9 49.53,209.17 v49.53,212.09 | U36.3 462.28,199.39 462.28,202.06 461.01,203.33 461.01,207.9 462.28,209.17 v462.28,212.09 | U45.3 81.28,199.39 81.28,202.18 80.01,203.45 80.01,207.9 81.28,209.17 v81.28,212.09 | U18.3 176.53,199.39 176.53,201.68 175.26,202.95 175.26,207.9 176.53,209.17 v176.53,212.09 | U62.3 208.28,199.39 208.28,201.55 207.01,202.82 207.01,207.9 208.28,209.17 v208.28,212.09 | U27.3 303.53,199.39 303.53,201.8 302.26,203.07 302.26,207.9 303.53,209.17 v303.53,212.09 | U79.3 335.28,199.39 335.28,201.68 334.01,202.95 334.01,207.9 335.28,209.17 v335.28,212.09 | v435.61,212.09 435.61,209.17 434.34,207.9 434.34,206.63 436.88,204.09 U156.14 436.88,138.43 438.15,137.16 v438.15,97.79
  Bottom 0.254: v49.53,212.09 v81.28,212.09 v176.53,212.09 v208.28,212.09 v303.53,212.09 v335.28,212.09 v435.61,212.09 v462.28,212.09 | U96.3 81.28,97.79 207.01,97.79 | 334.01,97.79 207.01,97.79 | 334.01,97.79 v438.15,97.79 459.74,97.79 U147.3 | 334.01,97.79 U130.3 | 207.01,97.79 U113.3
A3
  Top 0.254: U156.15 435.61,152.4 435.61,179.07 | 435.61,179.07 U157.1 | 435.61,179.07 435.61,196.85 U158.1
A4
  Top 0.254: U158.2 431.8,197.87 433.07,196.6 433.07,179.07 | 433.07,179.07 U157.2 | 433.07,179.07 433.07,152.4 U156.16
A5
  Top 0.254: U156.17 430.53,152.4 430.53,179.07 | 430.53,179.07 U157.3 | 430.53,179.07 430.53,196.85 U158.3
D0  (via drill 0.51 pad 0.99)
  Top 0.254: U8.19 v24.13,207.01 U44.2 | U6.19 54.61,208.28 v54.61,207.01 54.61,180.34 U42.2 | U4.19 86.36,208.28 v86.36,207.01 86.36,180.34 U40.2 | U38.2 v119.38,207.01 U2.19 | U61.2 v151.13,207.01 U17.19 | U15.19 181.61,208.28 v181.61,207.01 181.61,180.34 U59.2 | U13.19 213.36,208.28 v213.36,207.01 213.36,180.34 U57.2 | U55.2 v246.38,207.01 U11.19 | U78.2 v278.13,207.01 U26.19 | U24.19 308.61,208.28 v308.61,207.01 308.61,180.34 U76.2 | U22.19 340.36,208.28 v340.36,207.01 340.36,180.34 U74.2 | U72.2 v373.38,207.01 U20.19 | v405.13,207.01 U31.19 | U29.19 435.61,208.28 v435.61,207.01 | U35.19 467.36,208.28 v467.36,207.01 467.36,153.67 466.09,152.4 466.09,137.16 U156.39 v467.36,105.41 467.36,78.74 U146.2 | v510.79,207.01 510.41,207.39 510.41,222.12 U32.19 | v500.38,207.01 U33.19 | U34.19 478.66,222.12 478.66,207.39 v479.04,207.01 | U28.19 446.91,222.12 446.91,207.39 v447.29,207.01 | U30.19 415.16,222.12 415.16,207.39 v415.54,207.01 | U19.19 383.41,222.12 383.41,207.39 v383.79,207.01 384.18,206.63 384.18,202.31 383.41,201.55 383.41,185.67 383.79,185.29 383.79,182.88 383.41,182.5 383.41,158.88 U71.2 | U21.19 351.66,222.12 351.66,207.39 v352.04,207.01 352.43,206.63 352.43,202.31 351.66,201.55 351.66,185.67 352.04,185.29 352.04,182.88 351.66,182.5 351.66,158.88 U73.2 | U23.19 319.91,222.12 319.91,207.39 v320.29,207.01 320.68,206.63 320.68,202.31 319.66,201.29 319.66,185.67 320.04,185.29 320.04,182.5 319.91,182.37 319.91,158.88 U75.2 | U7.19 34.16,222.12 34.16,207.39 v34.54,207.01 34.92,206.63 34.92,202.31 33.91,201.29 33.91,185.67 34.29,185.29 34.29,182.5 34.16,182.37 34.16,158.88 U43.2
  Top 0.254: U5.19 65.91,222.12 65.91,207.39 v66.29,207.01 66.67,206.63 66.67,202.31 65.66,201.29 65.66,185.67 66.04,185.29 66.04,182.5 65.91,182.37 65.91,158.88 U41.2 | U3.19 97.66,222.12 97.66,207.39 v98.04,207.01 98.42,206.63 98.42,202.31 97.66,201.55 97.66,185.67 98.04,185.29 98.04,182.88 97.66,182.5 97.66,158.88 U39.2 | U1.19 129.41,222.12 129.41,207.39 v129.79,207.01 130.18,206.63 130.18,202.31 129.41,201.55 129.41,185.67 129.79,185.29 129.79,182.88 129.41,182.5 129.41,158.88 U37.2 | U16.19 161.16,222.12 161.16,207.39 v161.54,207.01 161.93,206.63 161.93,202.31 160.91,201.29 160.91,185.67 161.29,185.29 161.29,182.5 161.16,182.37 161.16,158.88 U60.2 | U14.19 192.91,222.12 192.91,207.39 v193.29,207.01 193.68,206.63 193.68,202.31 192.66,201.29 192.66,185.67 193.04,185.29 193.04,182.5 192.91,182.37 192.91,158.88 U58.2 | U12.19 224.66,222.12 224.66,207.39 v225.04,207.01 225.43,206.63 225.43,202.31 224.66,201.55 224.66,185.67 225.04,185.29 225.04,182.88 224.66,182.5 224.66,158.88 U56.2 | U10.19 256.41,222.12 256.41,207.39 v256.79,207.01 257.18,206.63 257.18,202.31 256.41,201.55 256.41,185.67 256.79,185.29 256.79,182.88 256.41,182.5 256.41,158.88 U54.2 | U25.19 288.16,222.12 288.16,207.39 v288.54,207.01 288.93,206.63 288.93,202.31 287.91,201.29 287.91,185.67 288.29,185.29 288.29,182.5 288.16,182.37 288.16,158.88 U77.2 | v383.79,105.41 384.18,105.03 384.18,100.71 383.41,99.95 383.41,84.07 383.79,83.69 383.79,81.28 383.41,80.9 383.41,57.28 U122.2 | v24.13,105.41 U95.2 | v373.38,105.41 U123.2 | v352.04,105.41 352.43,105.03 352.43,100.71 351.66,99.95 351.66,84.07 352.04,83.69 352.04,81.28 351.66,80.9 351.66,57.28 U124.2
  Top 0.254: v34.54,105.41 34.92,105.03 34.92,100.71 34.16,99.95 34.16,84.07 34.54,83.69 34.54,81.28 34.16,80.9 34.16,57.28 U94.2 | v340.36,105.41 340.36,78.74 U125.2 | v320.29,105.41 320.68,105.03 320.68,100.71 319.91,99.95 319.91,84.07 320.29,83.69 320.29,81.28 319.91,80.9 319.91,57.28 U126.2 | v66.29,105.41 66.67,105.03 66.67,100.71 65.91,99.95 65.91,84.07 66.29,83.69 66.29,81.28 65.91,80.9 65.91,57.28 U92.2 | v86.36,105.41 86.36,78.74 U91.2 | v309.88,105.41 U127.2 | v288.54,105.41 288.93,105.03 288.93,100.71 288.16,99.95 288.16,84.07 288.54,83.69 288.54,81.28 288.16,80.9 288.16,57.28 U128.2 | v98.04,105.41 98.42,105.03 98.42,100.71 97.66,99.95 97.66,84.07 98.04,83.69 98.04,81.28 97.66,80.9 97.66,57.28 U90.2 | v119.38,105.41 U89.2 | v278.13,105.41 U129.2 | v256.79,105.41 257.18,105.03 257.18,100.71 256.41,99.95 256.41,84.07 256.79,83.69 256.79,81.28 256.41,80.9 256.41,57.28 U105.2 | v129.79,105.41 130.18,105.03 130.18,100.71 129.41,99.95 129.41,84.07 129.79,83.69 129.79,81.28 129.41,80.9 129.41,57.28 U88.2 | v151.13,105.41 U112.2 | v246.38,105.41 U106.2 | v225.04,105.41 225.43,105.03 225.43,100.71 224.66,99.95 224.66,84.07 225.04,83.69 225.04,81.28 224.66,80.9 224.66,57.28 U107.2 | v161.54,105.41 161.93,105.03 161.93,100.71 161.16,99.95 161.16,84.07 161.54,83.69 161.54,81.28 161.16,80.9 161.16,57.28 U111.2 | v213.36,105.41 213.36,78.74 U108.2 | v193.29,105.41 193.68,105.03 193.68,100.71 192.91,99.95 192.91,84.07 193.29,83.69 193.29,81.28 192.91,80.9 192.91,57.28 U109.2 | v55.88,105.41 U93.2 | v182.88,105.41 U110.2 | v405.13,105.41 U142.2 | v436.88,105.41 U140.2
  Top 0.254: v500.38,105.41 U144.2 | v510.79,105.41 511.18,105.03 511.18,100.71 510.41,99.95 510.41,84.07 510.79,83.69 510.79,81.28 510.41,80.9 510.41,57.28 U143.2 | v479.04,105.41 479.43,105.03 479.43,100.71 478.66,99.95 478.66,84.07 479.04,83.69 479.04,81.28 478.66,80.9 478.66,57.28 U145.2 | v447.29,105.41 447.68,105.03 447.68,100.71 446.91,99.95 446.91,84.07 447.29,83.69 447.29,81.28 446.91,80.9 446.91,57.28 U139.2 | v415.54,105.41 415.93,105.03 415.93,100.71 415.16,99.95 415.16,84.07 415.54,83.69 415.54,81.28 415.16,80.9 415.16,57.28 U141.2
  Bottom 0.254: v510.79,207.01 v500.38,207.01 v479.04,207.01 v467.36,207.01 v447.29,207.01 v435.61,207.01 v415.54,207.01 v405.13,207.01 v383.79,207.01 v373.38,207.01 v352.04,207.01 v340.36,207.01 v320.29,207.01 v308.61,207.01 v288.54,207.01 v278.13,207.01 v256.79,207.01 v246.38,207.01 v225.04,207.01 v213.36,207.01 v193.29,207.01 v181.61,207.01 v161.54,207.01 v151.13,207.01 v129.79,207.01 v119.38,207.01 v98.04,207.01 v86.36,207.01 v66.29,207.01 v54.61,207.01 v34.54,207.01 v24.13,207.01 | v510.79,105.41 v500.38,105.41 v479.04,105.41 v467.36,105.41 v447.29,105.41 v436.88,105.41 v415.54,105.41 v405.13,105.41 v383.79,105.41 v373.38,105.41 v352.04,105.41 v340.36,105.41 v320.29,105.41 v309.88,105.41 v288.54,105.41 v278.13,105.41 v256.79,105.41 v246.38,105.41 v225.04,105.41 v213.36,105.41 v193.29,105.41 v182.88,105.41 v161.54,105.41 v151.13,105.41 v129.79,105.41 v119.38,105.41 v98.04,105.41 v86.36,105.41 v66.29,105.41 v55.88,105.41 v34.54,105.41 v24.13,105.41
D1  (via drill 0.51 pad 0.99)
  Top 0.254: U60.3 160.66,156.84 160.66,182.63 160.78,182.75 160.78,185.04 160.4,185.42 160.4,201.55 161.42,202.56 161.42,205.36 v161.04,205.74 160.66,206.12 160.66,224.16 U16.18 | U8.18 v21.59,205.74 U44.3 | U6.18 52.07,208.28 v52.07,205.74 52.07,180.34 U42.3 | U40.3 83.82,180.34 v83.82,205.74 83.82,208.28 U4.18 | U38.3 v116.84,205.74 U2.18 | U61.3 v148.59,205.74 U17.18 | U59.3 179.07,180.34 v179.07,205.74 179.07,208.28 U15.18 | U13.18 210.82,208.28 v210.82,205.74 210.82,180.34 U57.3 | U55.3 v243.84,205.74 U11.18 | U78.3 v275.59,205.74 U26.18 | U24.18 306.07,208.28 v306.07,205.74 306.07,180.34 U76.3 | U22.18 337.82,208.28 v337.82,205.74 337.82,180.34 U74.3 | U72.3 v370.84,205.74 U20.18 | v402.59,205.74 U31.18 | U29.18 433.07,208.28 v433.07,205.74 | U35.18 464.82,208.28 v464.82,205.74 464.82,153.67 463.55,152.4 463.55,137.16 U156.38 v464.82,104.14 464.82,78.74 U146.3 | v510.29,205.74 509.9,206.12 509.9,224.16 U32.18 | v497.84,205.74 U33.18 | U34.18 478.15,224.16 478.15,206.12 v478.54,205.74 | U28.18 446.4,224.16 446.4,206.12 v446.79,205.74 | U30.18 414.65,224.16 414.65,206.12 v415.04,205.74 | U19.18 382.9,224.16 382.9,206.12 v383.29,205.74 383.67,205.36 383.67,202.56 382.9,201.8 382.9,185.42 383.29,185.04 383.29,183.13 382.9,182.75 382.9,156.84 U71.3 | U21.18 351.15,224.16 351.15,206.12 v351.54,205.74 351.92,205.36 351.92,202.56 351.15,201.8 351.15,185.42 351.54,185.04 351.54,183.13 351.15,182.75 351.15,156.84 U73.3 | U23.18 319.4,224.16 319.4,206.12 v319.79,205.74 320.17,205.36 320.17,202.56 319.15,201.55 319.15,185.42 319.53,185.04 319.53,182.75 319.4,182.63 319.4,156.84 U75.3
  Top 0.254: U7.18 33.66,224.16 33.66,206.12 v34.04,205.74 34.42,205.36 34.42,202.56 33.4,201.55 33.4,185.42 33.78,185.04 33.78,182.75 33.66,182.63 33.66,156.84 U43.3 | U5.18 65.41,224.16 65.41,206.12 v65.79,205.74 66.17,205.36 66.17,202.56 65.15,201.55 65.15,185.42 65.53,185.04 65.53,182.75 65.41,182.63 65.41,156.84 U41.3 | U3.18 97.16,224.16 97.16,206.12 v97.54,205.74 97.92,205.36 97.92,202.56 97.16,201.8 97.16,185.42 97.54,185.04 97.54,183.13 97.16,182.75 97.16,156.84 U39.3 | U1.18 128.91,224.16 128.91,206.12 v129.29,205.74 129.67,205.36 129.67,202.56 128.91,201.8 128.91,185.42 129.29,185.04 129.29,183.13 128.91,182.75 128.91,156.84 U37.3 | U14.18 192.41,224.16 192.41,206.12 v192.79,205.74 193.17,205.36 193.17,202.56 192.15,201.55 192.15,185.42 192.53,185.04 192.53,182.75 192.41,182.63 192.41,156.84 U58.3 | U12.18 224.16,224.16 224.16,206.12 v224.54,205.74 224.92,205.36 224.92,202.56 224.16,201.8 224.16,185.42 224.54,185.04 224.54,183.13 224.16,182.75 224.16,156.84 U56.3 | U10.18 255.91,224.16 255.91,206.12 v256.29,205.74 256.67,205.36 256.67,202.56 255.91,201.8 255.91,185.42 256.29,185.04 256.29,183.13 255.91,182.75 255.91,156.84 U54.3 | U25.18 287.65,224.16 287.65,206.12 v288.04,205.74 288.42,205.36 288.42,202.56 287.4,201.55 287.4,185.42 287.78,185.04 287.78,182.75 287.65,182.63 287.65,156.84 U77.3 | v383.29,104.14 383.67,103.76 383.67,100.97 382.9,100.2 382.9,83.82 383.29,83.44 383.29,81.53 382.9,81.15 382.9,55.24 U122.3 | v370.84,104.14 U123.3 | v351.54,104.14 351.92,103.76 351.92,100.97 351.15,100.2 351.15,83.82 351.54,83.44 351.54,81.53 351.15,81.15 351.15,55.24 U124.3
  Top 0.254: v337.82,104.14 337.82,78.74 U125.3 | v319.79,104.14 320.17,103.76 320.17,100.97 319.4,100.2 319.4,83.82 319.79,83.44 319.79,81.53 319.4,81.15 319.4,55.24 U126.3 | v307.34,104.14 U127.3 | v288.04,104.14 288.42,103.76 288.42,100.97 287.65,100.2 287.65,83.82 288.04,83.44 288.04,81.53 287.65,81.15 287.65,55.24 U128.3 | v275.59,104.14 U129.3 | v256.29,104.14 256.67,103.76 256.67,100.97 255.91,100.2 255.91,83.82 256.29,83.44 256.29,81.53 255.91,81.15 255.91,55.24 U105.3 | v21.59,104.14 U95.3 | v243.84,104.14 U106.3 | v224.54,104.14 224.92,103.76 224.92,100.97 224.16,100.2 224.16,83.82 224.54,83.44 224.54,81.53 224.16,81.15 224.16,55.24 U107.3 | v34.04,104.14 34.42,103.76 34.42,100.97 33.66,100.2 33.66,83.82 34.04,83.44 34.04,81.53 33.66,81.15 33.66,55.24 U94.3 | v210.82,104.14 210.82,78.74 U108.3 | v192.79,104.14 193.17,103.76 193.17,100.97 192.41,100.2 192.41,83.82 192.79,83.44 192.79,81.53 192.41,81.15 192.41,55.24 U109.3 | v65.79,104.14 66.17,103.76 66.17,100.97 65.41,100.2 65.41,83.82 65.79,83.44 65.79,81.53 65.41,81.15 65.41,55.24 U92.3 | v83.82,104.14 83.82,78.74 U91.3 | v161.04,104.14 161.42,103.76 161.42,100.97 160.66,100.2 160.66,83.82 161.04,83.44 161.04,81.53 160.66,81.15 160.66,55.24 U111.3 | v97.54,104.14 97.92,103.76 97.92,100.97 97.16,100.2 97.16,83.82 97.54,83.44 97.54,81.53 97.16,81.15 97.16,55.24 U90.3 | v116.84,104.14 U89.3 | v148.59,104.14 U112.3 | v129.29,104.14 129.67,103.76 129.67,100.97 128.91,100.2 128.91,83.82 129.29,83.44 129.29,81.53 128.91,81.15 128.91,55.24 U88.3 | v53.34,104.14 U93.3 | v180.34,104.14 U110.3 | v402.59,104.14 U142.3
  Top 0.254: U140.3 v434.34,104.14 | v497.84,104.14 U144.3 | v510.29,104.14 510.67,103.76 510.67,100.97 509.9,100.2 509.9,83.82 510.29,83.44 510.29,81.53 509.9,81.15 509.9,55.24 U143.3 | v478.54,104.14 478.92,103.76 478.92,100.97 478.15,100.2 478.15,83.82 478.54,83.44 478.54,81.53 478.15,81.15 478.15,55.24 U145.3 | v446.79,104.14 447.17,103.76 447.17,100.97 446.4,100.2 446.4,83.82 446.79,83.44 446.79,81.53 446.4,81.15 446.4,55.24 U139.3 | v415.04,104.14 415.42,103.76 415.42,100.97 414.65,100.2 414.65,83.82 415.04,83.44 415.04,81.53 414.65,81.15 414.65,55.24 U141.3
  Bottom 0.254: v510.29,205.74 v497.84,205.74 v478.54,205.74 v464.82,205.74 v446.79,205.74 v433.07,205.74 v415.04,205.74 v402.59,205.74 v383.29,205.74 v370.84,205.74 v351.54,205.74 v337.82,205.74 v319.79,205.74 v306.07,205.74 v288.04,205.74 v275.59,205.74 v256.29,205.74 v243.84,205.74 v224.54,205.74 v210.82,205.74 v192.79,205.74 v179.07,205.74 v161.04,205.74 v148.59,205.74 v129.29,205.74 v116.84,205.74 v97.54,205.74 v83.82,205.74 v65.79,205.74 v52.07,205.74 v34.04,205.74 v21.59,205.74 | v510.29,104.14 v497.84,104.14 v478.54,104.14 v464.82,104.14 v446.79,104.14 v434.34,104.14 v415.04,104.14 v402.59,104.14 v383.29,104.14 v370.84,104.14 v351.54,104.14 v337.82,104.14 v319.79,104.14 v307.34,104.14 v288.04,104.14 v275.59,104.14 v256.29,104.14 v243.84,104.14 v224.54,104.14 v210.82,104.14 v192.79,104.14 v180.34,104.14 v161.04,104.14 v148.59,104.14 v129.29,104.14 v116.84,104.14 v97.54,104.14 v83.82,104.14 v65.79,104.14 v53.34,104.14 v34.04,104.14 v21.59,104.14
D2  (via drill 0.51 pad 0.99)
  Top 0.254: U8.17 v19.05,204.47 U44.4 | U6.17 49.53,208.28 v49.53,204.47 50.04,203.96 50.04,199.01 49.53,198.5 49.53,180.34 U42.4 | U4.17 81.28,208.28 v81.28,204.47 81.79,203.96 81.79,199.01 81.28,198.5 81.28,180.34 U40.4 | U38.4 v114.3,204.47 U2.17 | U61.4 v146.05,204.47 U17.17 | U15.17 176.53,208.28 v176.53,204.47 177.04,203.96 177.04,199.01 176.53,198.5 176.53,180.34 U59.4 | U13.17 208.28,208.28 v208.28,204.47 208.79,203.96 208.79,199.01 208.28,198.5 208.28,180.34 U57.4 | U55.4 v241.3,204.47 U11.17 | U78.4 v273.05,204.47 U26.17 | U24.17 303.53,208.28 v303.53,204.47 304.04,203.96 304.04,199.01 303.53,198.5 303.53,180.34 U76.4 | U22.17 335.28,208.28 v335.28,204.47 335.79,203.96 335.79,199.01 335.28,198.5 335.28,180.34 U74.4 | U72.4 v368.3,204.47 U20.17 | v400.05,204.47 U31.17 | U29.17 430.53,208.28 v430.53,204.47 | U35.17 462.28,208.28 v462.28,204.47 462.79,203.96 462.79,199.01 462.28,198.5 462.28,153.67 461.01,152.4 461.01,137.16 U156.37 v462.28,102.87 462.28,78.74 U146.4 | v509.78,204.47 509.4,204.85 509.4,226.19 U32.17 | v495.3,204.47 U33.17 | U34.17 477.65,226.19 477.65,204.85 v478.03,204.47 | U28.17 445.9,226.19 445.9,204.85 v446.28,204.47 | U30.17 414.15,226.19 414.15,204.85 v414.53,204.47 | U19.17 382.4,226.19 382.4,204.85 v382.78,204.47 383.16,204.09 383.16,202.82 382.4,202.06 382.4,185.17 382.78,184.78 382.78,183.39 382.4,183.01 382.4,154.81 U71.4 | U21.17 350.65,226.19 350.65,204.85 v351.03,204.47 351.41,204.09 351.41,202.82 350.65,202.06 350.65,185.17 351.03,184.78 351.03,183.39 350.65,183.01 350.65,154.81 U73.4 | U23.17 318.9,226.19 318.9,204.85 v319.28,204.47 319.66,204.09 319.66,202.82 318.64,201.8 318.64,185.17 319.02,184.78 319.02,183.01 318.9,182.88 318.9,154.81 U75.4
  Top 0.254: U7.17 33.15,226.19 33.15,204.85 v33.53,204.47 33.91,204.09 33.91,202.82 32.89,201.8 32.89,185.17 33.27,184.78 33.27,183.01 33.15,182.88 33.15,154.81 U43.4 | U5.17 64.9,226.19 64.9,204.85 v65.28,204.47 65.66,204.09 65.66,202.82 64.64,201.8 64.64,185.17 65.02,184.78 65.02,183.01 64.9,182.88 64.9,154.81 U41.4 | U3.17 96.65,226.19 96.65,204.85 v97.03,204.47 97.41,204.09 97.41,202.82 96.65,202.06 96.65,185.17 97.03,184.78 97.03,183.39 96.65,183.01 96.65,154.81 U39.4 | U1.17 128.4,226.19 128.4,204.85 v128.78,204.47 129.16,204.09 129.16,202.82 128.4,202.06 128.4,185.17 128.78,184.78 128.78,183.39 128.4,183.01 128.4,154.81 U37.4 | U16.17 160.15,226.19 160.15,204.85 v160.53,204.47 160.91,204.09 160.91,202.82 159.89,201.8 159.89,185.17 160.27,184.78 160.27,183.01 160.15,182.88 160.15,154.81 U60.4 | U14.17 191.9,226.19 191.9,204.85 v192.28,204.47 192.66,204.09 192.66,202.82 191.64,201.8 191.64,185.17 192.02,184.78 192.02,183.01 191.9,182.88 191.9,154.81 U58.4 | U12.17 223.65,226.19 223.65,204.85 v224.03,204.47 224.41,204.09 224.41,202.82 223.65,202.06 223.65,185.17 224.03,184.78 224.03,183.39 223.65,183.01 223.65,154.81 U56.4 | U10.17 255.4,226.19 255.4,204.85 v255.78,204.47 256.16,204.09 256.16,202.82 255.4,202.06 255.4,185.17 255.78,184.78 255.78,183.39 255.4,183.01 255.4,154.81 U54.4 | U25.17 287.15,226.19 287.15,204.85 v287.53,204.47 287.91,204.09 287.91,202.82 286.89,201.8 286.89,185.17 287.27,184.78 287.27,183.01 287.15,182.88 287.15,154.81 U77.4 | v19.05,102.87 U95.4 | v33.53,102.87 33.91,102.49 33.91,101.22 33.15,100.46 33.15,83.57 33.53,83.19 33.53,81.79 33.15,81.41 33.15,53.21 U94.4
  Top 0.254: v65.28,102.87 65.66,102.49 65.66,101.22 64.9,100.46 64.9,83.57 65.28,83.19 65.28,81.79 64.9,81.41 64.9,53.21 U92.4 | v81.28,102.87 81.28,78.74 U91.4 | v97.03,102.87 97.41,102.49 97.41,101.22 96.65,100.46 96.65,83.57 97.03,83.19 97.03,81.79 96.65,81.41 96.65,53.21 U90.4 | v114.3,102.87 U89.4 | v128.78,102.87 129.16,102.49 129.16,101.22 128.4,100.46 128.4,83.57 128.78,83.19 128.78,81.79 128.4,81.41 128.4,53.21 U88.4 | v146.05,102.87 U112.4 | v160.53,102.87 160.91,102.49 160.91,101.22 160.15,100.46 160.15,83.57 160.53,83.19 160.53,81.79 160.15,81.41 160.15,53.21 U111.4 | v192.28,102.87 192.66,102.49 192.66,101.22 191.9,100.46 191.9,83.57 192.28,83.19 192.28,81.79 191.9,81.41 191.9,53.21 U109.4 | v208.28,102.87 208.28,78.74 U108.4 | v224.03,102.87 224.41,102.49 224.41,101.22 223.65,100.46 223.65,83.57 224.03,83.19 224.03,81.79 223.65,81.41 223.65,53.21 U107.4 | v241.3,102.87 U106.4 | v255.78,102.87 256.16,102.49 256.16,101.22 255.4,100.46 255.4,83.57 255.78,83.19 255.78,81.79 255.4,81.41 255.4,53.21 U105.4 | v273.05,102.87 U129.4 | v287.53,102.87 287.91,102.49 287.91,101.22 287.15,100.46 287.15,83.57 287.53,83.19 287.53,81.79 287.15,81.41 287.15,53.21 U128.4 | v304.8,102.87 U127.4 | v319.28,102.87 319.66,102.49 319.66,101.22 318.9,100.46 318.9,83.57 319.28,83.19 319.28,81.79 318.9,81.41 318.9,53.21 U126.4 | v335.28,102.87 335.28,78.74 U125.4 | v351.03,102.87 351.41,102.49 351.41,101.22 350.65,100.46 350.65,83.57 351.03,83.19 351.03,81.79 350.65,81.41 350.65,53.21 U124.4 | v368.3,102.87 U123.4 | v382.78,102.87 383.16,102.49 383.16,101.22 382.4,100.46 382.4,83.57 382.78,83.19 382.78,81.79 382.4,81.41 382.4,53.21 U122.4
  Top 0.254: v50.8,102.87 U93.4 | v177.8,102.87 U110.4 | v400.05,102.87 U142.4 | U140.4 v431.8,102.87 | v495.3,102.87 U144.4 | v509.78,102.87 510.16,102.49 510.16,101.22 509.4,100.46 509.4,83.57 509.78,83.19 509.78,81.79 509.4,81.41 509.4,53.21 U143.4 | v478.03,102.87 478.41,102.49 478.41,101.22 477.65,100.46 477.65,83.57 478.03,83.19 478.03,81.79 477.65,81.41 477.65,53.21 U145.4 | v446.28,102.87 446.66,102.49 446.66,101.22 445.9,100.46 445.9,83.57 446.28,83.19 446.28,81.79 445.9,81.41 445.9,53.21 U139.4 | v414.53,102.87 414.91,102.49 414.91,101.22 414.15,100.46 414.15,83.57 414.53,83.19 414.53,81.79 414.15,81.41 414.15,53.21 U141.4
  Bottom 0.254: v509.78,204.47 v495.3,204.47 v478.03,204.47 v462.28,204.47 v446.28,204.47 v430.53,204.47 v414.53,204.47 v400.05,204.47 v382.78,204.47 v368.3,204.47 v351.03,204.47 v335.28,204.47 v319.28,204.47 v303.53,204.47 v287.53,204.47 v273.05,204.47 v255.78,204.47 v241.3,204.47 v224.03,204.47 v208.28,204.47 v192.28,204.47 v176.53,204.47 v160.53,204.47 v146.05,204.47 v128.78,204.47 v114.3,204.47 v97.03,204.47 v81.28,204.47 v65.28,204.47 v49.53,204.47 v33.53,204.47 v19.05,204.47 | v19.05,102.87 v33.53,102.87 v50.8,102.87 v65.28,102.87 v81.28,102.87 v97.03,102.87 v114.3,102.87 v128.78,102.87 v146.05,102.87 v160.53,102.87 v177.8,102.87 v192.28,102.87 v208.28,102.87 v224.03,102.87 v241.3,102.87 v255.78,102.87 v273.05,102.87 v287.53,102.87 v304.8,102.87 v319.28,102.87 v335.28,102.87 v351.03,102.87 v368.3,102.87 v382.78,102.87 v400.05,102.87 v414.53,102.87 v431.8,102.87 v446.28,102.87 v462.28,102.87 v478.03,102.87 v495.3,102.87 v509.78,102.87
D3  (via drill 0.51 pad 0.99)
  Top 0.254: U8.16 v16.51,203.2 U44.5 | U6.16 46.99,208.28 v46.99,203.2 46.99,180.34 U42.5 | U40.5 78.74,180.34 v78.74,203.2 78.74,208.28 U4.16 | U38.5 v111.76,203.2 U2.16 | U61.5 v143.51,203.2 U17.16 | U59.5 173.99,180.34 v173.99,203.2 173.99,208.28 U15.16 | U13.16 205.74,208.28 v205.74,203.2 205.74,180.34 U57.5 | U55.5 v238.76,203.2 U11.16 | U78.5 v270.51,203.2 U26.16 | U76.5 300.99,180.34 v300.99,203.2 300.99,208.28 U24.16 | U22.16 332.74,208.28 v332.74,203.2 332.74,180.34 U74.5 | U72.5 v365.76,203.2 U20.16 | U29.16 427.99,208.28 v427.99,203.2 | v397.51,203.2 U31.16 | U35.16 459.74,208.28 v459.74,203.2 459.74,153.67 458.47,152.4 458.47,137.16 U156.36 v459.74,101.6 459.74,78.74 U146.5 | v509.27,203.2 508.89,203.58 508.89,226.44 U32.16 | v492.76,203.2 U33.16 | U34.16 477.14,226.44 477.14,203.58 v477.52,203.2 | U28.16 445.39,226.44 445.39,203.58 v445.77,203.2 | U30.16 413.64,226.44 413.64,203.58 v414.02,203.2 | U19.16 381.89,226.44 381.89,203.58 v382.27,203.2 381.89,202.82 381.89,184.91 382.27,184.53 382.27,183.64 381.89,183.26 381.89,154.56 U71.5 | U21.16 350.14,226.44 350.14,203.58 v350.52,203.2 350.14,202.82 350.14,184.91 350.52,184.53 350.52,183.64 350.14,183.26 350.14,154.56 U73.5 | U23.16 318.39,226.44 318.39,203.58 v318.77,203.2 318.13,202.56 318.13,184.91 318.52,184.53 318.52,183.26 318.39,183.13 318.39,154.56 U75.5 | U7.16 32.64,226.44 32.64,203.58 v33.02,203.2 32.38,202.56 32.38,184.91 32.77,184.53 32.77,183.26 32.64,183.13 32.64,154.56 U43.5 | U5.16 64.39,226.44 64.39,203.58 v64.77,203.2 64.14,202.56 64.14,184.91 64.52,184.53 64.52,183.26 64.39,183.13 64.39,154.56 U41.5
  Top 0.254: U3.16 96.14,226.44 96.14,203.58 v96.52,203.2 96.14,202.82 96.14,184.91 96.52,184.53 96.52,183.64 96.14,183.26 96.14,154.56 U39.5 | U1.16 127.89,226.44 127.89,203.58 v128.27,203.2 127.89,202.82 127.89,184.91 128.27,184.53 128.27,183.64 127.89,183.26 127.89,154.56 U37.5 | U16.16 159.64,226.44 159.64,203.58 v160.02,203.2 159.38,202.56 159.38,184.91 159.77,184.53 159.77,183.26 159.64,183.13 159.64,154.56 U60.5 | U14.16 191.39,226.44 191.39,203.58 v191.77,203.2 191.13,202.56 191.13,184.91 191.52,184.53 191.52,183.26 191.39,183.13 191.39,154.56 U58.5 | U12.16 223.14,226.44 223.14,203.58 v223.52,203.2 223.14,202.82 223.14,184.91 223.52,184.53 223.52,183.64 223.14,183.26 223.14,154.56 U56.5 | U10.16 254.89,226.44 254.89,203.58 v255.27,203.2 254.89,202.82 254.89,184.91 255.27,184.53 255.27,183.64 254.89,183.26 254.89,154.56 U54.5 | U25.16 286.64,226.44 286.64,203.58 v287.02,203.2 286.38,202.56 286.38,184.91 286.77,184.53 286.77,183.26 286.64,183.13 286.64,154.56 U77.5 | v382.27,101.6 381.89,101.22 381.89,83.31 382.27,82.93 382.27,82.04 381.89,81.66 381.89,52.96 U122.5 | v365.76,101.6 U123.5 | v350.52,101.6 350.14,101.22 350.14,83.31 350.52,82.93 350.52,82.04 350.14,81.66 350.14,52.96 U124.5 | v332.74,101.6 332.74,78.74 U125.5 | v318.77,101.6 318.39,101.22 318.39,83.31 318.77,82.93 318.77,82.04 318.39,81.66 318.39,52.96 U126.5 | v302.26,101.6 U127.5 | v287.02,101.6 286.64,101.22 286.64,83.31 287.02,82.93 287.02,82.04 286.64,81.66 286.64,52.96 U128.5 | v270.51,101.6 U129.5 | v255.27,101.6 254.89,101.22 254.89,83.31 255.27,82.93 255.27,82.04 254.89,81.66 254.89,52.96 U105.5
  Top 0.254: v16.51,101.6 U95.5 | v238.76,101.6 U106.5 | v223.52,101.6 223.14,101.22 223.14,83.31 223.52,82.93 223.52,82.04 223.14,81.66 223.14,52.96 U107.5 | v33.02,101.6 32.64,101.22 32.64,83.31 33.02,82.93 33.02,82.04 32.64,81.66 32.64,52.96 U94.5 | v205.74,101.6 205.74,78.74 U108.5 | v191.77,101.6 191.39,101.22 191.39,83.31 191.77,82.93 191.77,82.04 191.39,81.66 191.39,52.96 U109.5 | v64.77,101.6 64.39,101.22 64.39,83.31 64.77,82.93 64.77,82.04 64.39,81.66 64.39,52.96 U92.5 | v78.74,101.6 78.74,78.74 U91.5 | v160.02,101.6 159.64,101.22 159.64,83.31 160.02,82.93 160.02,82.04 159.64,81.66 159.64,52.96 U111.5 | v96.52,101.6 96.14,101.22 96.14,83.31 96.52,82.93 96.52,82.04 96.14,81.66 96.14,52.96 U90.5 | v111.76,101.6 U89.5 | v143.51,101.6 U112.5 | v128.27,101.6 127.89,101.22 127.89,83.31 128.27,82.93 128.27,82.04 127.89,81.66 127.89,52.96 U88.5 | v48.26,101.6 U93.5 | v175.26,101.6 U110.5 | v397.51,101.6 U142.5 | v429.26,101.6 U140.5 | v492.76,101.6 U144.5 | v509.27,101.6 508.89,101.22 508.89,83.31 509.27,82.93 509.27,82.04 508.89,81.66 508.89,52.96 U143.5 | v477.52,101.6 477.14,101.22 477.14,83.31 477.52,82.93 477.52,82.04 477.14,81.66 477.14,52.96 U145.5 | v445.77,101.6 445.39,101.22 445.39,83.31 445.77,82.93 445.77,82.04 445.39,81.66 445.39,52.96 U139.5 | v414.02,101.6 413.64,101.22 413.64,83.31 414.02,82.93 414.02,82.04 413.64,81.66 413.64,52.96 U141.5
  Bottom 0.254: v16.51,203.2 v33.02,203.2 v46.99,203.2 v64.77,203.2 v78.74,203.2 v96.52,203.2 v111.76,203.2 v128.27,203.2 v143.51,203.2 v160.02,203.2 v173.99,203.2 v191.77,203.2 v205.74,203.2 v223.52,203.2 v238.76,203.2 v255.27,203.2 v270.51,203.2 v287.02,203.2 v300.99,203.2 v318.77,203.2 v332.74,203.2 v350.52,203.2 v365.76,203.2 v382.27,203.2 v397.51,203.2 v414.02,203.2 v427.99,203.2 v445.77,203.2 v459.74,203.2 v477.52,203.2 v492.76,203.2 v509.27,203.2 | v509.27,101.6 v492.76,101.6 v477.52,101.6 v459.74,101.6 v445.77,101.6 v429.26,101.6 v414.02,101.6 v397.51,101.6 v382.27,101.6 v365.76,101.6 v350.52,101.6 v332.74,101.6 v318.77,101.6 v302.26,101.6 v287.02,101.6 v270.51,101.6 v255.27,101.6 v238.76,101.6 v223.52,101.6 v205.74,101.6 v191.77,101.6 v175.26,101.6 v160.02,101.6 v143.51,101.6 v128.27,101.6 v111.76,101.6 v96.52,101.6 v78.74,101.6 v64.77,101.6 v48.26,101.6 v33.02,101.6 v16.51,101.6
D4  (via drill 0.51 pad 0.99)